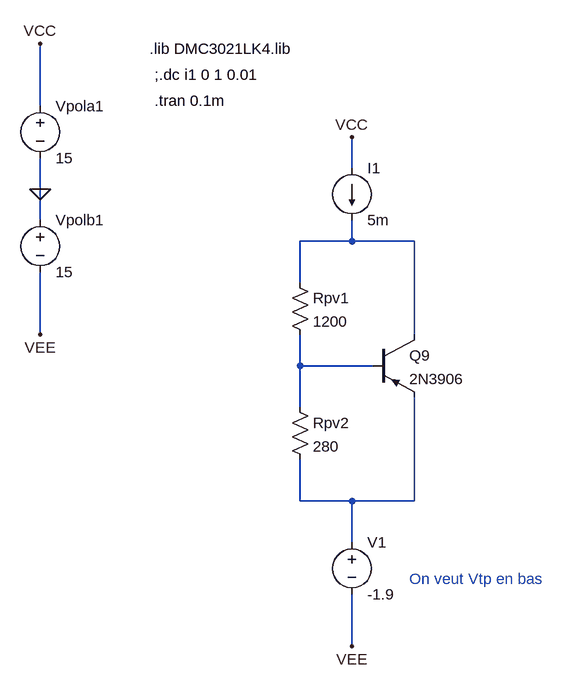
[diagram p0: schematic VBE_Seul.asc]
VBE_Seul.asc, the LTspice schematic file:
Version 4
SHEET 1 1288 1196
WIRE -448 288 -448 192
WIRE 32 384 32 336
WIRE -448 416 -448 368
WIRE -448 464 -448 416
WIRE 32 496 32 464
WIRE 32 496 -48 496
WIRE 128 496 32 496
WIRE -48 560 -48 496
WIRE -448 640 -448 544
WIRE 128 640 128 496
WIRE -48 688 -48 640
WIRE 64 688 -48 688
WIRE -48 752 -48 688
WIRE -48 896 -48 832
WIRE 32 896 -48 896
WIRE 128 896 128 736
WIRE 128 896 32 896
WIRE 32 960 32 896
WIRE 32 1120 32 1040
FLAG -448 192 VCC
FLAG -448 640 VEE
FLAG -448 416 0
FLAG 32 336 VCC
FLAG 32 1120 VEE
SYMBOL pnp 64 640 R0
SYMATTR InstName Q9
SYMATTR Value 2N3906
SYMBOL voltage -448 272 R0
WINDOW 123 0 0 Left 0
WINDOW 39 0 0 Left 0
SYMATTR InstName Vpola1
SYMATTR Value 15
SYMBOL voltage -448 448 R0
WINDOW 123 0 0 Left 0
WINDOW 39 0 0 Left 0
SYMATTR InstName Vpolb1
SYMATTR Value 15
SYMBOL Res -64 544 R0
SYMATTR InstName Rpv1
SYMATTR Value 1200
SYMBOL Res -64 736 R0
SYMATTR InstName Rpv2
SYMATTR Value 280
SYMBOL current 32 384 R0
SYMATTR InstName I1
SYMATTR Value 5m
SYMBOL Voltage 32 944 R0
SYMATTR InstName V1
SYMATTR Value -1.9
TEXT -280 200 Left 2 !.lib DMC3021LK4.lib
TEXT -272 240 Left 2 !;.dc i1 0 1 0.01
TEXT -272 280 Left 2 !.tran 0.1m
TEXT 120 1016 Left 2 ;On veut Vtp en bas

The netlist it stands for:
* VBE_Seul.asc
Q9 N001 N002 N003 0 2N3906
Vpola1 VCC 0 15
Vpolb1 0 VEE 15
Rpv1 N001 N002 1200
Rpv2 N002 N003 280
I1 VCC N001 5m
V1 N003 VEE -1.9
.model NPN NPN
.model PNP PNP
.lib standard.bjt
.lib DMC3021LK4.lib
;.dc i1 0 1 0.01
.tran 0.1m
* On veut Vtp en bas
.backanno
.end